# EAGLE design C64 SCSI-Interface (EAGLE 6.6.0)
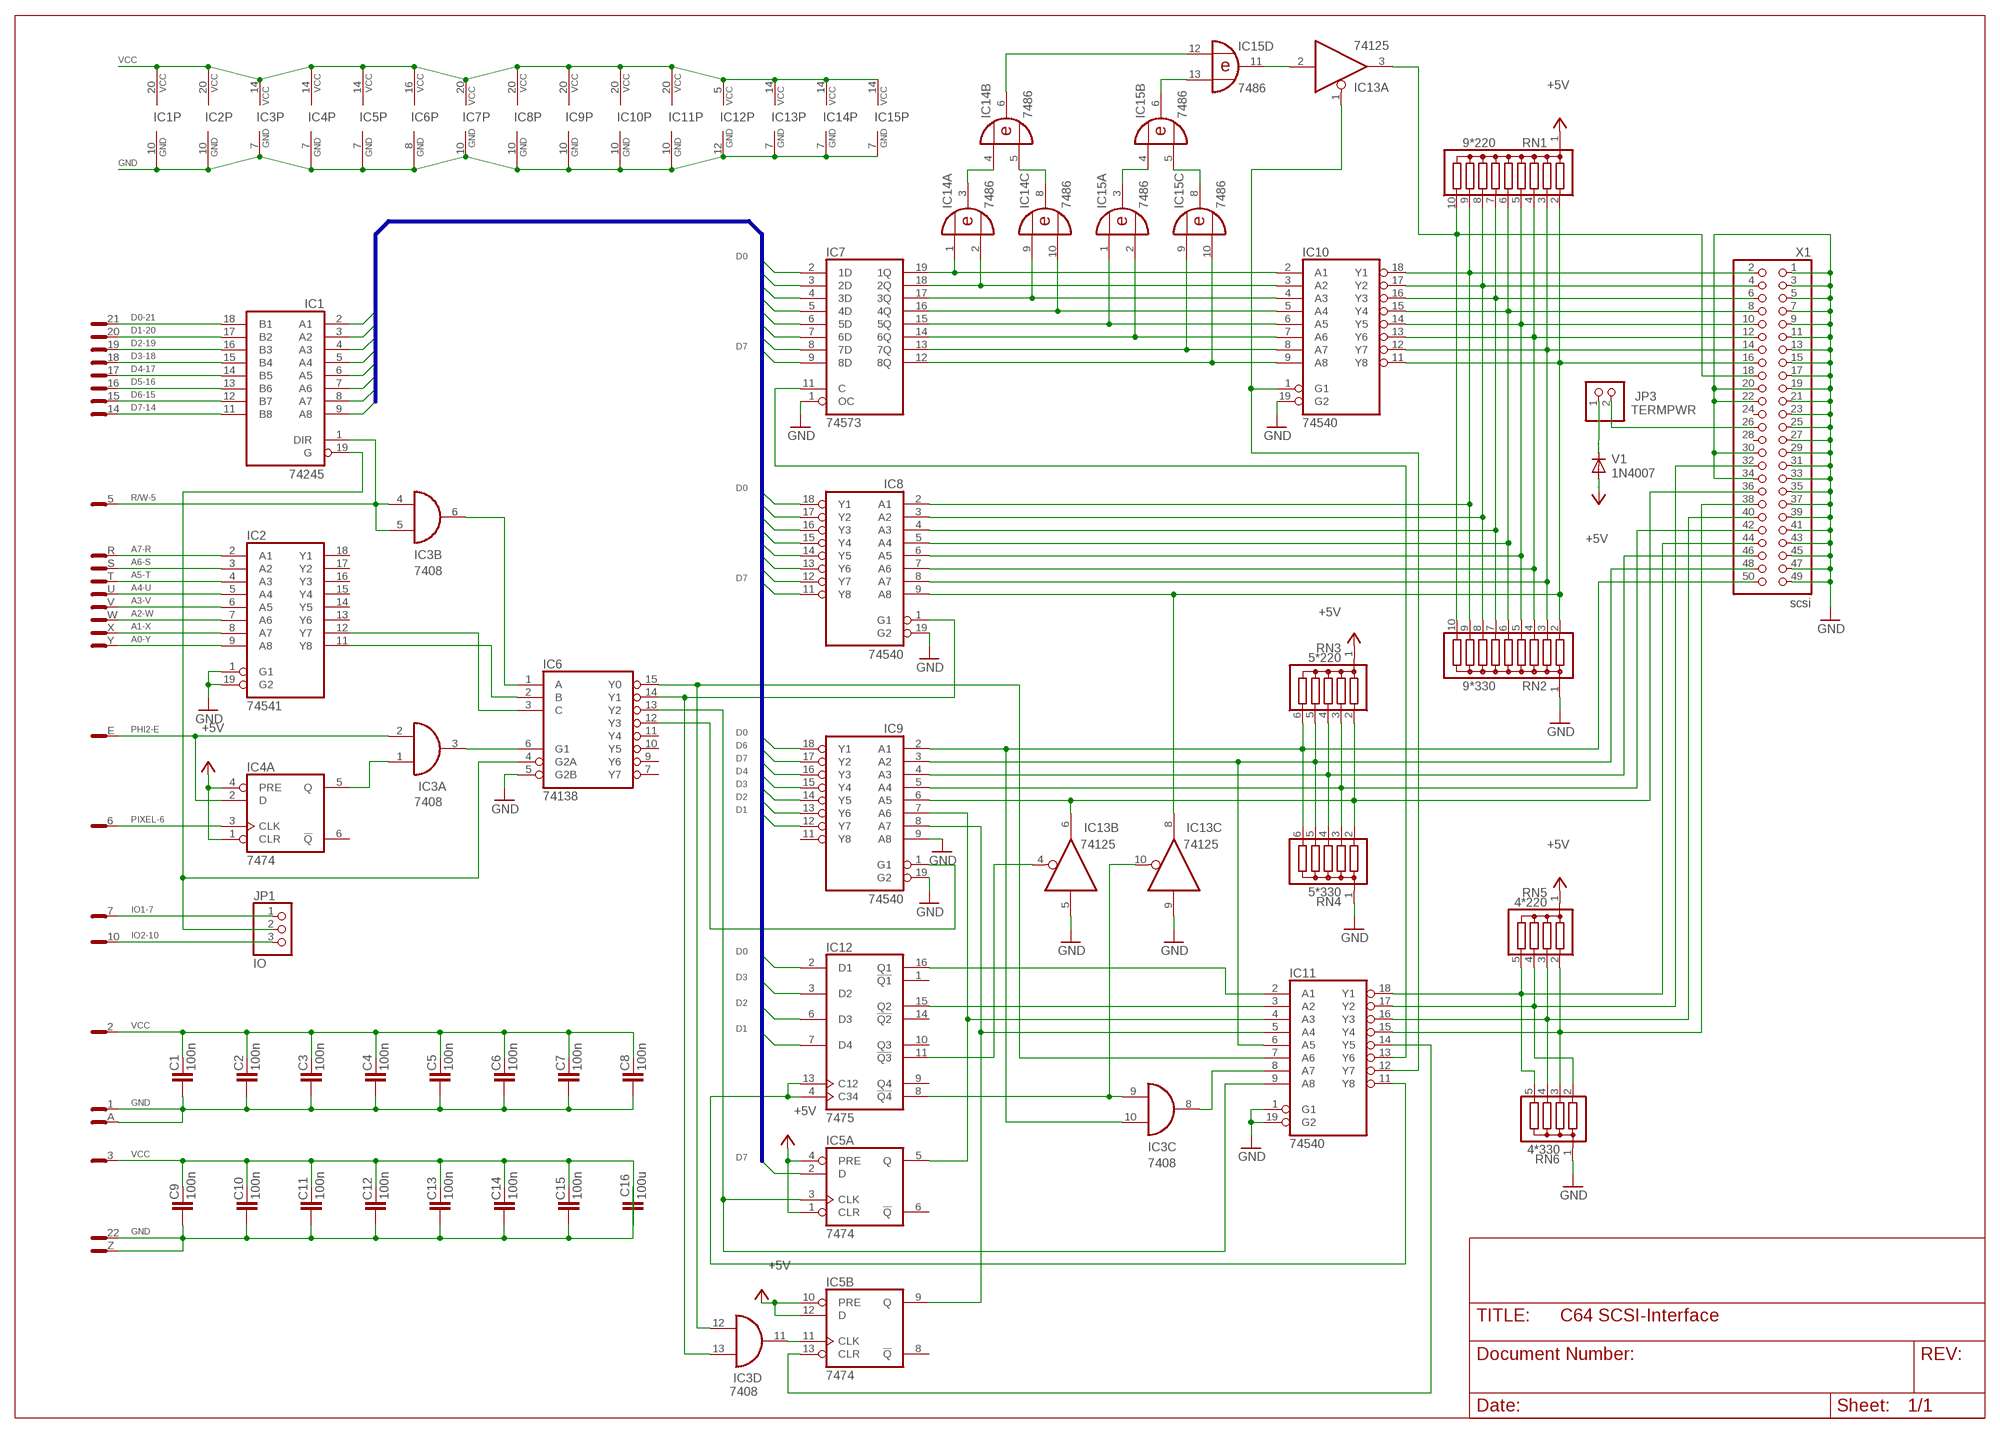
[diagram p0: schematic, sheet 1]

## Parts
C1  100n  C-EU050-025X075  [C050-025X075]
C2  100n  C-EU050-025X075  [C050-025X075]
C3  100n  C-EU050-025X075  [C050-025X075]
C4  100n  C-EU050-025X075  [C050-025X075]
C5  100n  C-EU050-025X075  [C050-025X075]
C6  100n  C-EU050-025X075  [C050-025X075]
C7  100n  C-EU050-025X075  [C050-025X075]
C8  100n  C-EU050-025X075  [C050-025X075]
C9  100n  C-EU050-025X075  [C050-025X075]
C10  100n  C-EU050-025X075  [C050-025X075]
C11  100n  C-EU050-025X075  [C050-025X075]
C12  100n  C-EU050-025X075  [C050-025X075]
C13  100n  C-EU050-025X075  [C050-025X075]
C14  100n  C-EU050-025X075  [C050-025X075]
C15  100n  C-EU050-025X075  [C050-025X075]
C16  100u  C-EU050-025X075  [C050-025X075]
IC1  74245  74LS245N  [DIL20]
IC2  74541  74LS541N  [DIL20]
IC3  7408  74LS08N  [DIL14]
IC4  7474  74LS74N  [DIL14]
IC5  7474  74LS74N  [DIL14]
IC6  74138  74LS138N  [DIL16]
IC7  74573  74HCT573N  [DIL20]
IC8  74540  74LS540N  [DIL20]
IC9  74540  74LS540N  [DIL20]
IC10  74540  74LS540N  [DIL20]
IC11  74540  74LS540N  [DIL20]
IC12  7475  74LS75N  [DIL16]
IC13  74125  74LS125N  [DIL14]
IC14  7486  74LS86N  [DIL14]
IC15  7486  74LS86N  [DIL14]
JP1  IO  PINHD-1X3  [1X03]
JP3  TERMPWR  PINHD-1X2  [1X02]
RN1  9*220  G09R  [SIL10]
RN2  9*330  G09R  [SIL10]
RN3  5*220  G05R  [SIL6]
RN4  5*330  G05R  [SIL6]
RN5  4*220  G04R  [SIL5]
RN6  4*330  G04R  [SIL5]
V1  1N4007  1N4004  [DO41-10]
X1  scsi  PINHD-2X25  [2X25]
X2  CARDCON22  [CARDCON2]

## Nets
A0: IC2.11(Y8) IC6.2(B)
A0-Y: IC2.9(A8) X2.Y
A1: IC2.12(Y7) IC6.3(C)
A1-X: IC2.8(A7) X2.X
A2-W: IC2.7(A6) X2.W
A3-V: IC2.6(A5) X2.V
A4-U: IC2.5(A4) X2.U
A5-T: IC2.4(A3) X2.T
A6-S: IC2.3(A2) X2.S
A7-R: IC2.2(A1) X2.R
D0: IC1.2(A1) IC7.2(1D) IC8.18(Y1) IC9.18(Y1) IC12.2(D1)
D0-21: IC1.18(B1) X2.21
D1: IC1.3(A2) IC7.3(2D) IC8.17(Y2) IC9.12(Y7) IC12.7(D4)
D1-20: IC1.17(B2) X2.20
D2: IC1.4(A3) IC7.4(3D) IC8.16(Y3) IC9.13(Y6) IC12.6(D3)
D2-19: IC1.16(B3) X2.19
D3: IC1.5(A4) IC7.5(4D) IC8.15(Y4) IC9.14(Y5) IC12.3(D2)
D3-18: IC1.15(B4) X2.18
D4: IC1.6(A5) IC7.6(5D) IC8.14(Y5) IC9.15(Y4)
D4-17: IC1.14(B5) X2.17
D5: IC1.7(A6) IC7.7(6D) IC8.13(Y6)
D5-16: IC1.13(B6) X2.16
D6: IC1.8(A7) IC7.8(7D) IC8.12(Y7) IC9.17(Y2)
D6-15: IC1.12(B7) X2.15
D7: IC1.9(A8) IC5.2(A:D) IC7.9(8D) IC8.11(Y8) IC9.16(Y3)
D7-14: IC1.11(B8) X2.14
GND: C1.1 C2.1 C3.1 C4.1 C5.1 C6.1 C7.1 C8.1 C9.1 C10.1 C11.1 C12.1 C13.1 C14.1 C15.1 C16.2 IC1.10(GND) IC2.1(G1) IC2.10(GND) IC2.19(G2) IC3.7(P:GND) IC4.7(P:GND) IC5.7(P:GND) IC6.5(G2B) IC6.8(GND) IC7.1(OC) IC7.10(GND) IC8.10(GND) IC8.19(G2) IC9.9(A8) IC9.10(GND) IC9.19(G2) IC10.10(GND) IC10.19(G2) IC11.1(G1) IC11.10(GND) IC11.19(G2) IC12.12(GND) IC13.5(B:I) IC13.7(P:GND) IC13.9(C:I) IC14.7(P:GND) IC15.7(P:GND) RN2.1 RN4.1 RN6.1 X1.1 X1.3 X1.5 X1.7 X1.9 X1.11 X1.13 X1.15 X1.17 X1.19 X1.20 X1.21 X1.22 X1.23 X1.25 X1.27 X1.29 X1.30 X1.31 X1.33 X1.34 X1.35 X1.37 X1.39 X1.41 X1.43 X1.45 X1.47 X1.49 X2.1 X2.22 X2.A X2.Z
IO: IC1.19(G) IC6.4(G2A) JP1.2
IO1-7: JP1.1 X2.7
IO2-10: JP1.3 X2.10
N$1: IC14.3(A:O) IC14.4(B:I0)
N$2: IC3.1(A:I0) IC4.5(A:Q)
N$3: IC6.12(Y3) IC9.1(G1)
N$4: IC14.5(B:I1) IC14.8(C:O)
N$5: IC14.6(B:O) IC15.12(D:I0)
N$6: IC15.6(B:O) IC15.13(D:I1)
N$7: IC15.3(A:O) IC15.4(B:I0)
N$8: IC15.5(B:I1) IC15.8(C:O)
N$9: IC3.11(D:O) IC5.11(B:CLK)
N$10: IC7.19(1Q) IC10.2(A1) IC14.1(A:I0)
N$11: IC7.18(2Q) IC10.3(A2) IC14.2(A:I1)
N$12: IC7.17(3Q) IC10.4(A3) IC14.9(C:I0)
N$13: IC7.16(4Q) IC10.5(A4) IC14.10(C:I1)
N$14: IC7.15(5Q) IC10.6(A5) IC15.1(A:I0)
N$15: IC7.14(6Q) IC10.7(A6) IC15.2(A:I1)
N$16: IC7.13(7Q) IC10.8(A7) IC15.9(C:I0)
N$17: IC7.12(8Q) IC10.9(A8) IC15.10(C:I1)
N$18: IC13.2(A:I) IC15.11(D:O)
N$19: IC10.1(G1) IC11.12(Y7) IC13.1(A:OE)
N$20: IC8.9(A8) IC10.11(Y8) IC13.8(C:O) RN1.2 RN2.2 X1.16
N$21: IC8.8(A7) IC10.12(Y7) RN1.3 RN2.3 X1.14
N$22: IC8.7(A6) IC10.13(Y6) RN1.4 RN2.4 X1.12
N$23: IC8.6(A5) IC10.14(Y5) RN1.5 RN2.5 X1.10
N$24: IC8.5(A4) IC10.15(Y4) RN1.6 RN2.6 X1.8
N$25: IC8.4(A3) IC10.16(Y3) RN1.7 RN2.7 X1.6
N$26: IC8.3(A2) IC10.17(Y2) RN1.8 RN2.8 X1.4
N$27: IC8.2(A1) IC10.18(Y1) RN1.9 RN2.9 X1.2
N$28: IC13.3(A:O) RN1.10 RN2.10 X1.18
N$29: IC3.9(C:I0) IC12.8(!Q4) IC13.10(C:OE)
N$30: IC12.11(!Q3) IC13.4(B:OE)
N$31: IC9.6(A5) IC13.6(B:O) RN3.2 RN4.2 X1.36
N$32: IC9.5(A4) RN3.3 RN4.3 X1.42
N$33: IC9.4(A3) RN3.4 RN4.4 X1.46
N$34: IC9.3(A2) IC11.6(A5) RN3.5 RN4.5 X1.48
N$35: IC3.10(C:I1) IC9.2(A1) RN3.6 RN4.6 X1.50
N$36: IC5.9(B:Q) IC9.8(A7) IC11.5(A4)
N$37: IC11.15(Y4) RN5.2 RN6.3 X1.38
N$38: IC11.16(Y3) RN5.3 RN6.4 X1.40
N$39: IC11.17(Y2) RN5.4 RN6.2 X1.32
N$40: IC11.18(Y1) RN5.5 RN6.5 X1.44
N$41: IC3.12(D:I0) IC6.15(Y0) IC11.7(A6)
N$42: IC5.3(A:CLK) IC6.13(Y2) IC11.9(A8)
N$43: IC5.5(A:Q) IC9.7(A6) IC11.4(A3)
N$44: IC3.13(D:I1) IC6.14(Y1) IC8.1(G1)
N$45: IC11.11(Y8) IC12.4(C34) IC12.13(C12)
N$46: IC11.2(A1) IC12.16(Q1)
N$47: IC11.3(A2) IC12.15(Q2)
N$49: IC5.13(B:CLR) IC11.14(Y5)
N$50: IC3.8(C:O) IC11.8(A7)
N$51: IC7.11(C) IC11.13(Y6)
N$53: JP3.1 V1.C
PHI2: IC3.3(A:O) IC6.6(G1)
PHI2-E: IC3.2(A:I1) IC4.2(A:D) X2.E
PIXEL-6: IC4.3(A:CLK) X2.6
R/-W: IC3.6(B:O) IC6.1(A)
R/W-5: IC1.1(DIR) IC3.4(B:I0) IC3.5(B:I1) X2.5
TERMPWR: JP3.2 X1.26
VCC: C1.2 C2.2 C3.2 C4.2 C5.2 C6.2 C7.2 C8.2 C9.2 C10.2 C11.2 C12.2 C13.2 C14.2 C15.2 C16.1 IC1.20(VCC) IC2.20(VCC) IC3.14(P:VCC) IC4.1(A:CLR) IC4.4(A:PRE) IC4.14(P:VCC) IC5.1(A:CLR) IC5.4(A:PRE) IC5.10(B:PRE) IC5.12(B:D) IC5.14(P:VCC) IC6.16(VCC) IC7.20(VCC) IC8.20(VCC) IC9.20(VCC) IC10.20(VCC) IC11.20(VCC) IC12.5(VCC) IC13.14(P:VCC) IC14.14(P:VCC) IC15.14(P:VCC) RN1.1 RN3.1 RN5.1 V1.A X2.2 X2.3 ; supply symbol labelled +5V
Unconnected: IC2.13(Y6) IC2.14(Y5) IC2.15(Y4) IC2.16(Y3) IC2.17(Y2) IC2.18(Y1) IC4.6(A:!Q) IC4.8(B:!Q) IC4.9(B:Q) IC4.10(B:PRE) IC4.11(B:CLK) IC4.12(B:D) IC4.13(B:CLR) IC5.6(A:!Q) IC5.8(B:!Q) IC6.7(Y7) IC6.9(Y6) IC6.10(Y5) IC6.11(Y4) IC9.11(Y8) IC12.1(!Q1) IC12.9(Q4) IC12.10(Q3) IC12.14(!Q2) IC13.11(D:O) IC13.12(D:I) IC13.13(D:OE) IC14.11(D:O) IC14.12(D:I0) IC14.13(D:I1) X1.24 X1.28 X2.4 X2.8 X2.9 X2.11 X2.12 X2.13 X2.B X2.C X2.D X2.F X2.H X2.J X2.K X2.L X2.M X2.N X2.P

## Buses
D[0..7]

## Library data of the parts
C1-C16 = rcl:C-EU: CAPACITOR, European symbol
IC1 = 74xx-us:74*245: Octal BUS TRANSCEIVER, 3-state
IC2 = 74xx-us:74*541: Octal BUFFER and LINE DRIVER, 3-state
IC3 = 74xx-eu:74*08: Quad 2-input AND gate
IC4 IC5 = 74xx-us:74*74: Dual D type positive edge triggered FLIP FLOP, preset and clear
IC6 = 74xx-us:74*138: 3-line to 8-line DECODER/DEMULTIPLEXER
IC7 = 74xx-eu:74*573: 8-bit D latch BUS DRIVER
IC8-IC11 = 74xx-us:74*540: Octal BUFFER and LINE DRIVER, 3-state
IC12 = 74xx-eu:74*75: 4-bit bistable LATCH
IC13 = 74xx-eu:74*125: Quad bus BUFFER, 3-state
IC14 IC15 = 74xx-eu:74*86: Quad 2-input EXCLUSIVE-OR (XOR) gate
JP1 = PINHEAD:PINHD-1X3: PIN HEADER
JP3 = PINHEAD:PINHD-1X2: PIN HEADER
RN1 RN2 = resistor-sil:G09R: SIL RESISTOR; OC_FARNELL: unknown; OC_NEWARK: unknown
RN3 RN4 = resistor-sil:G05R: SIL RESISTOR; OC_FARNELL: unknown; OC_NEWARK: unknown
RN5 RN6 = resistor-sil:G04R: SIL RESISTOR; OC_FARNELL: unknown; OC_NEWARK: unknown
V1 = diode:1N4004: DIODE general purpose rectifier, 1 A
X1 = PINHEAD:PINHD-2X25: PIN HEADER
X2 = CONNECT2:CARDCON22

## Board
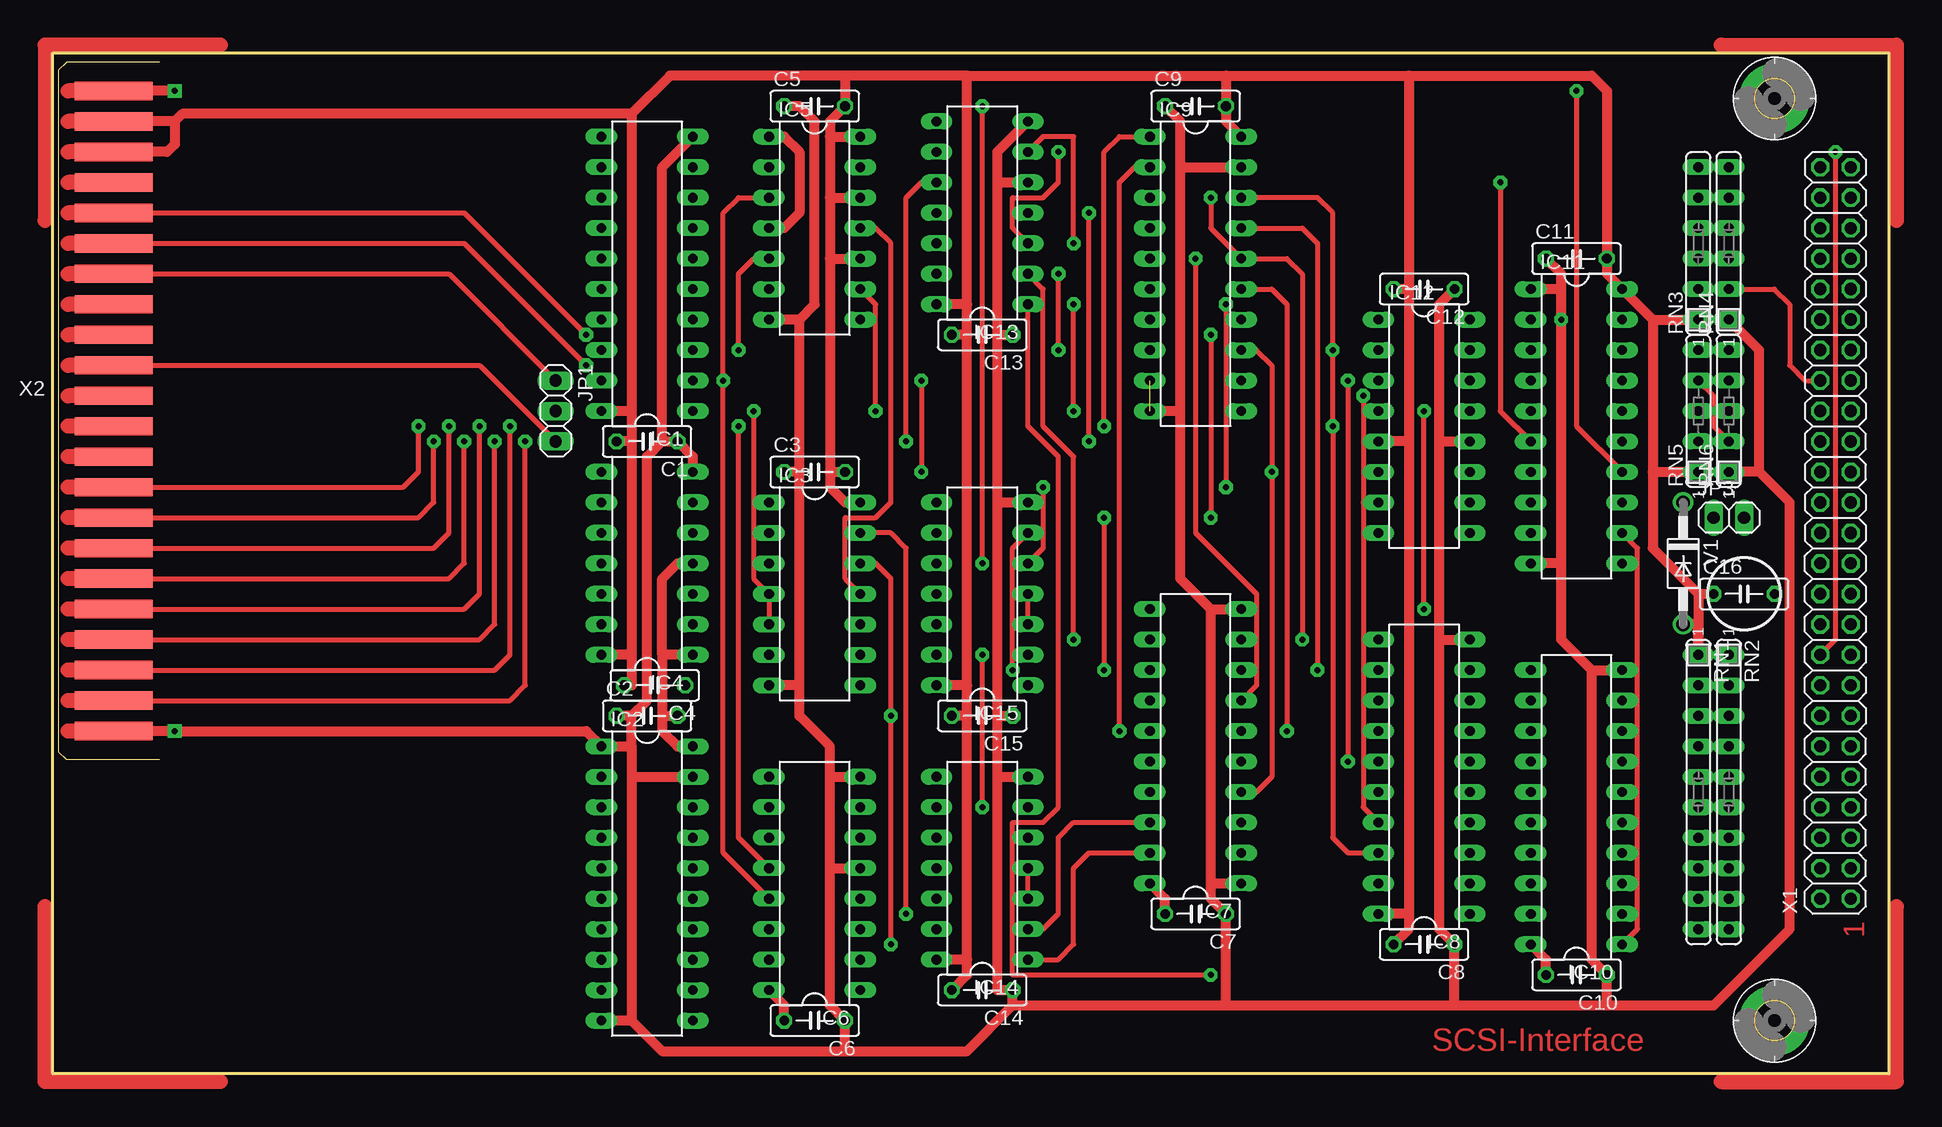
[diagram p1: board, top side]
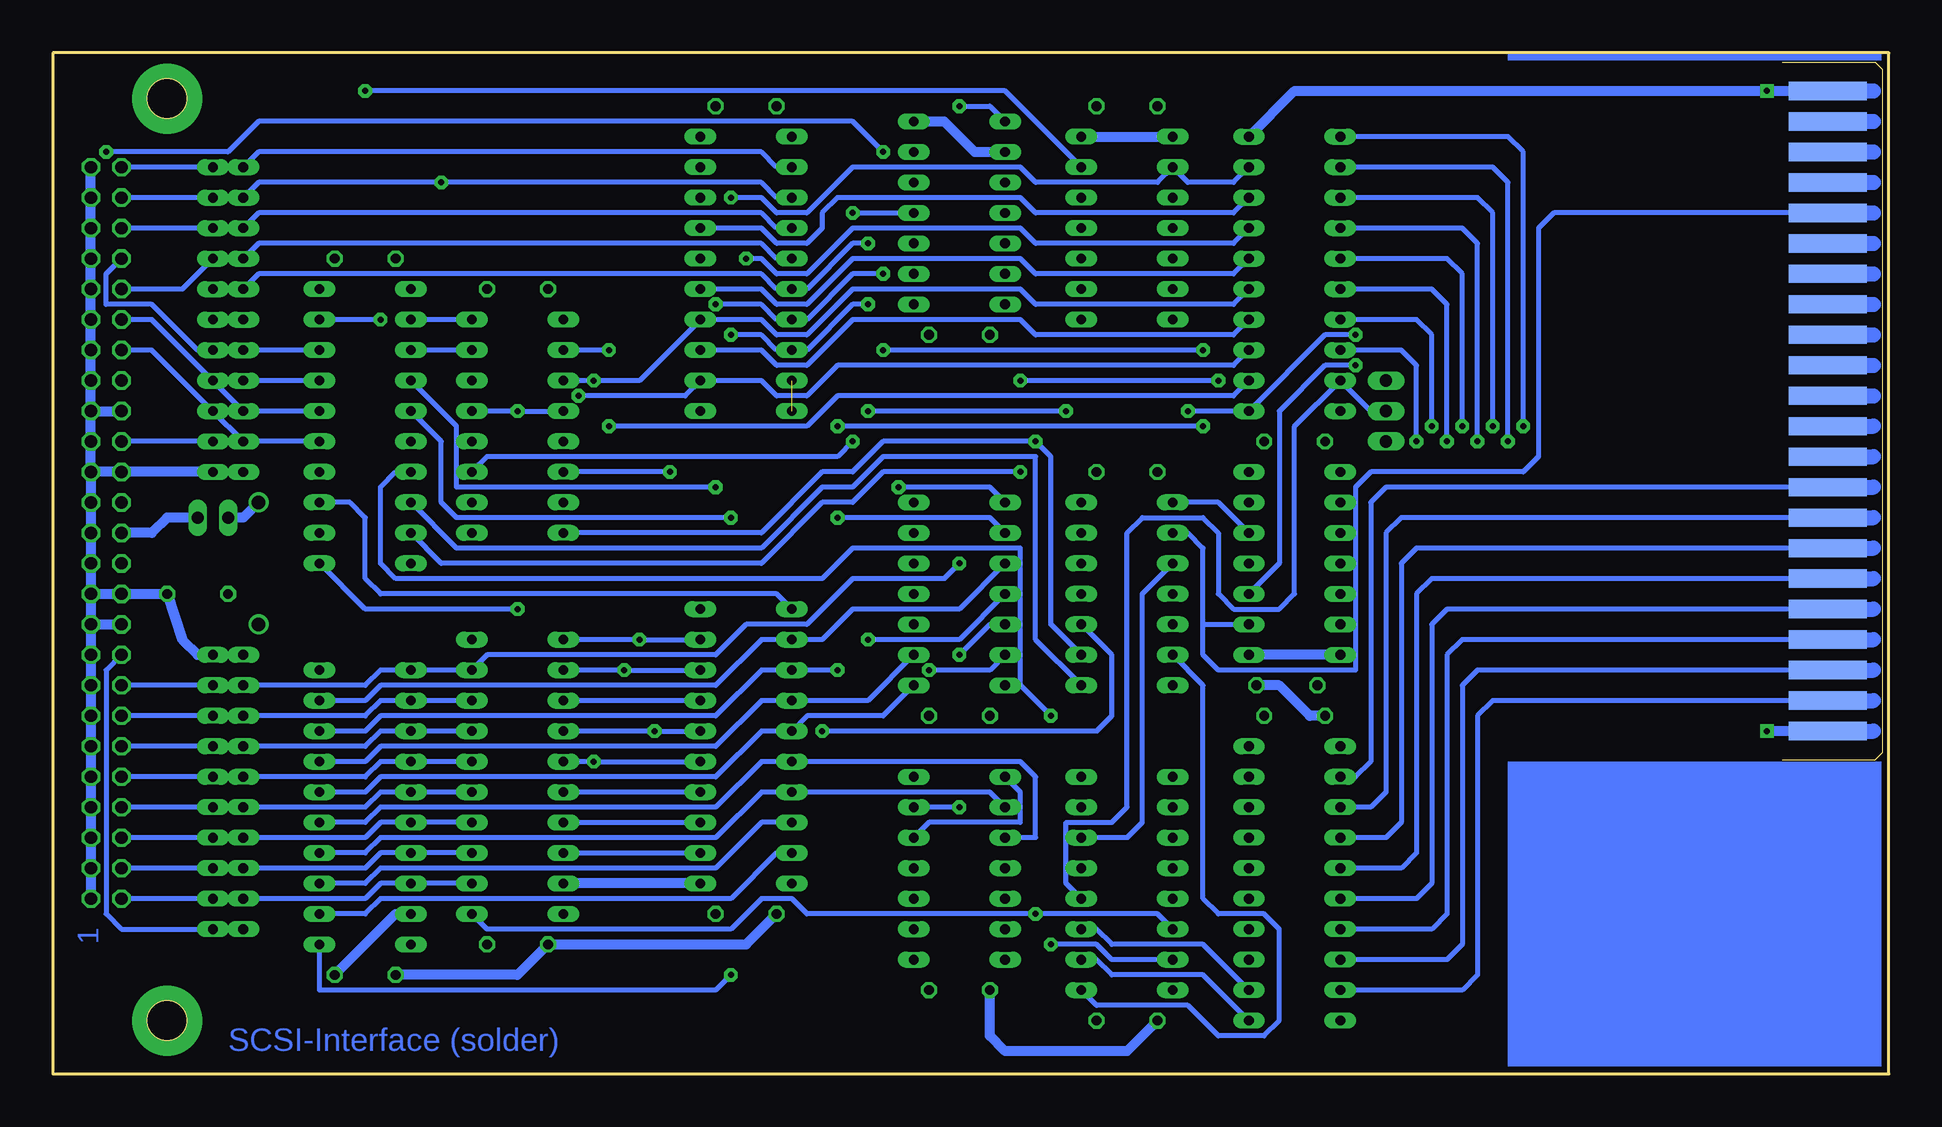
[diagram p2: board, bottom side, seen from below]

Size 153.03 x 85.09 mm. Coordinates in mm from the lower left corner, seen from the top.
Outline: 0,0 0,85.09 153.03,85.09 153.03,0 0,0
Copper layers (1*16): Top 0.035mm / dielectric 1.5mm / Bottom 0.035mm
Design rules "default *": minimum track width 10mil, minimum drill 19mil, track to track 8mil, track to pad 8mil, pad to pad 8mil, via to via 8mil, smd to smd 8mil, copper to edge 40mil, drill to drill 8mil, minimum pad ring 10mil, minimum via ring 8mil, stop-mask expansion 4mil, vias tented up to drill 0mil, thermal gap 10mil

### Footprints (pad centres in the part's own frame; a part is rotated, then mirrored left to right if it is on the bottom)
C050-025X075 = drill 0.813 octagon: 1 -2.54,0; 2 2.54,0
BO3,2-P = drill 3.2 pad 5.842: B3,2 0,0
DIL20 = drill 0.813 long: 1 -11.43,-3.81; 2 -8.89,-3.81; 3 -6.35,-3.81; 4 -3.81,-3.81; 5 -1.27,-3.81; 6 1.27,-3.81; 7 3.81,-3.81; 8 6.35,-3.81; 9 8.89,-3.81; 10 11.43,-3.81; 11 11.43,3.81; 12 8.89,3.81; 13 6.35,3.81; 14 3.81,3.81; 15 1.27,3.81; 16 -1.27,3.81; 17 -3.81,3.81; 18 -6.35,3.81; 19 -8.89,3.81; 20 -11.43,3.81
DIL14 = drill 0.813 long: 1 -7.62,-3.81; 2 -5.08,-3.81; 3 -2.54,-3.81; 4 0,-3.81; 5 2.54,-3.81; 6 5.08,-3.81; 7 7.62,-3.81; 8 7.62,3.81; 9 5.08,3.81; 10 2.54,3.81; 11 0,3.81; 12 -2.54,3.81; 13 -5.08,3.81; 14 -7.62,3.81
DIL16 = drill 0.813 long: 1 -8.89,-3.81; 2 -6.35,-3.81; 3 -3.81,-3.81; 4 -1.27,-3.81; 5 1.27,-3.81; 6 3.81,-3.81; 7 6.35,-3.81; 8 8.89,-3.81; 9 8.89,3.81; 10 6.35,3.81; 11 3.81,3.81; 12 1.27,3.81; 13 -1.27,3.81; 14 -3.81,3.81; 15 -6.35,3.81; 16 -8.89,3.81
1X03 = drill 1.016 long: 1 -2.54,0; 2 0,0; 3 2.54,0
1X02 = drill 1.016 long: 1 -1.27,0; 2 1.27,0
SIL10 = drill 0.813 long: 1 -11.43,0; 2 -8.89,0; 3 -6.35,0; 4 -3.81,0; 5 -1.27,0; 6 1.27,0; 7 3.81,0; 8 6.35,0; 9 8.89,0; 10 11.43,0
SIL6 = drill 0.813 long: 1 -6.35,0; 2 -3.81,0; 3 -1.27,0; 4 1.27,0; 5 3.81,0; 6 6.35,0
SIL5 = drill 0.813 long: 1 -5.08,0; 2 -2.54,0; 3 0,0; 4 2.54,0; 5 5.08,0
DO41-10 = drill 1.118: A 5.08,0; C -5.08,0
2X25 = drill 1.016 octagon: 1 -30.48,-1.27; 2 -30.48,1.27; 3 -27.94,-1.27; 4 -27.94,1.27; 5 -25.4,-1.27; 6 -25.4,1.27; 7 -22.86,-1.27; 8 -22.86,1.27; 9 -20.32,-1.27; 10 -20.32,1.27; 11 -17.78,-1.27; 12 -17.78,1.27; 13 -15.24,-1.27; 14 -15.24,1.27; 15 -12.7,-1.27; 16 -12.7,1.27; 17 -10.16,-1.27; 18 -10.16,1.27; 19 -7.62,-1.27; 20 -7.62,1.27; 21 -5.08,-1.27; 22 -5.08,1.27; 23 -2.54,-1.27; 24 -2.54,1.27; 25 0,-1.27; 26 0,1.27; 27 2.54,-1.27; 28 2.54,1.27; 29 5.08,-1.27; 30 5.08,1.27; 31 7.62,-1.27; 32 7.62,1.27; 33 10.16,-1.27; 34 10.16,1.27; 35 12.7,-1.27; 36 12.7,1.27; 37 15.24,-1.27; 38 15.24,1.27; 39 17.78,-1.27; 40 17.78,1.27; 41 20.32,-1.27; 42 20.32,1.27; 43 22.86,-1.27; 44 22.86,1.27; 45 25.4,-1.27; 46 25.4,1.27; 47 27.94,-1.27; 48 27.94,1.27; 49 30.48,-1.27; 50 30.48,1.27
CARDCON2 = smd 1.524 x 6.477: 1 55.88,3.81; 2 53.34,3.81; 3 50.8,3.81; 4 48.26,3.81; 5 45.72,3.81; 6 43.18,3.81; 7 40.64,3.81; 8 38.1,3.81; 9 35.56,3.81; 10 33.02,3.81; 11 30.48,3.81; 12 27.94,3.81; 13 25.4,3.81; 14 22.86,3.81; 15 20.32,3.81; 16 17.78,3.81; 17 15.24,3.81; 18 12.7,3.81; 19 10.16,3.81; 20 7.62,3.81; 21 5.08,3.81; 22 2.54,3.81 | smd 1.524 x 6.477 bottom: A 55.88,3.81; B 53.34,3.81; C 50.8,3.81; D 48.26,3.81; E 45.72,3.81; F 43.18,3.81; H 40.64,3.81; J 38.1,3.81; K 35.56,3.81; L 33.02,3.81; M 30.48,3.81; N 27.94,3.81; P 25.4,3.81; R 22.86,3.81; S 20.32,3.81; T 17.78,3.81; U 15.24,3.81; V 12.7,3.81; W 10.16,3.81; X 7.62,3.81; Y 5.08,3.81; Z 2.54,3.81

### Placement (x,y rotation side)
C1  49.53,52.7 180 top
C2  49.53,29.84 0 top
C3  63.5,50.16 0 top
C4  50.16,32.38 180 top
C5  63.5,80.65 0 top
C6  63.5,4.45 180 top
C7  95.25,13.34 180 top
C8  114.3,10.79 180 top
C9  95.25,80.65 0 top
C10  127,8.26 180 top
C11  127,67.95 0 top
C12  114.3,65.41 180 top
C13  77.47,61.59 180 top
C14  77.47,6.99 180 top
C15  77.47,29.84 180 top
C16  140.97,40 0 top
E$1  [BO3,2-P]  143.51,4.45 0 top
E$2  [BO3,2-P]  143.51,81.28 0 top
IC1  49.53,66.67 90 top
IC2  49.53,15.88 270 top
IC3  63.5,40 270 top
IC4  49.53,42.54 90 top
IC5  63.5,70.48 270 top
IC6  63.5,15.88 90 top
IC7  95.25,27.3 90 top
IC8  114.3,24.77 90 top
IC9  95.25,66.67 270 top
IC10  127,22.23 90 top
IC11  127,53.97 270 top
IC12  114.3,53.97 270 top
IC13  77.47,71.76 90 top
IC14  77.47,17.14 90 top
IC15  77.47,40 90 top
JP1  41.91,55.24 270 top
JP3  139.7,46.35 0 top
RN1  137.16,23.5 270 top
RN2  139.7,23.5 270 top
RN3  137.16,69.22 90 top
RN4  139.7,69.22 90 top
RN5  137.16,55.24 90 top
RN6  139.7,55.24 90 top
V1  135.89,42.54 270 top
X1  148.59,45.08 90 top
X2  8.89,26.04 90 top

### Tracks (layer width: path | path; a pad name or v marks a point on that pad's centre or on a via)
A0
  Bottom 0.406: IC2.11 57.15,8.26 64.77,8.26 66.04,9.53 IC6.2
A0-Y
  Bottom 0.406: IC2.9 35.56,6.99 34.29,8.26 34.29,29.84 33.02,31.11 X2.Y
A1
  Bottom 0.406: IC2.12 57.15,10.79 64.77,10.79 66.04,12.07 IC6.3
A1-X
  Bottom 0.406: IC2.8 36.83,9.53 35.56,10.79 35.56,32.38 34.29,33.65 X2.X
A2-W
  Bottom 0.406: IC2.7 38.1,12.07 36.83,13.34 36.83,34.92 35.56,36.2 X2.W
A3-V
  Bottom 0.406: IC2.6 39.37,14.61 38.1,15.88 38.1,37.46 36.83,38.73 X2.V
A4-U
  Bottom 0.406: IC2.5 40.64,17.14 39.37,18.41 39.37,40 38.1,41.27 X2.U
A5-T
  Bottom 0.406: IC2.4 41.91,19.68 40.64,20.96 40.64,42.54 39.37,43.81 X2.T
A6-S
  Bottom 0.406: IC2.3 43.18,22.23 41.91,23.5 41.91,45.08 40.64,46.35 X2.S
A7-R
  Bottom 0.406: IC2.2 44.45,24.77 43.18,26.04 43.18,47.62 41.91,48.89 X2.R
D0  (via drill 0.5 pad 1.14)
  Top 0.406: IC9.18 105.41,73.03 106.68,71.76 v106.68,60.32 v106.68,53.97 106.68,19.68 107.95,18.41 IC8.18
  Bottom 0.406: IC8.18 IC7.2 | IC1.2 54.61,56.51 87.63,56.51 90.17,53.97 v106.68,53.97 | v106.68,60.32 IC12.2
D0-21  (via drill 0.5 pad 1.14)
  Top 0.406: X2.21 38.1,31.11 39.37,32.38 v39.37,52.7
  Bottom 0.406: IC1.18 40.64,60.32 39.37,59.05 v39.37,52.7
D1  (via drill 0.5 pad 1.14)
  Top 0.406: 109.22,47.62 109.22,22.23 IC8.17 | 109.22,47.62 IC12.7 | v109.22,56.51 109.22,47.62
  Bottom 0.406: IC8.17 IC7.3 | IC1.3 54.61,59.05 87.63,59.05 90.17,56.51 92.71,56.51 93.98,57.78 IC9.12 100.33,56.51 v109.22,56.51
D1-20  (via drill 0.5 pad 1.14)
  Top 0.406: X2.20 36.83,33.65 38.1,34.92 v38.1,53.97
  Bottom 0.406: IC1.17 39.37,62.87 38.1,61.59 v38.1,53.97
D2  (via drill 0.5 pad 1.14)
  Top 0.406: IC9.13 100.33,60.32 101.6,59.05 v101.6,50.16 101.6,24.77 100.33,23.5 IC7.4
  Bottom 0.406: IC7.4 IC8.16 | IC1.4 54.61,61.59 71.12,61.59 72.39,62.87 86.36,62.87 90.17,59.05 92.71,59.05 93.98,60.32 IC9.13 | v101.6,50.16 IC12.6
D2-19  (via drill 0.5 pad 1.14)
  Top 0.406: X2.19 35.56,36.2 36.83,37.46 v36.83,52.7
  Bottom 0.406: IC1.16 38.1,65.41 36.83,64.14 v36.83,52.7
D3  (via drill 0.5 pad 1.14)
  Top 0.406: v107.95,57.78 v107.95,26.04
  Bottom 0.406: IC7.5 v107.95,26.04 IC8.15 | IC1.5 54.61,64.14 71.12,64.14 72.39,65.41 86.36,65.41 90.17,61.59 92.71,61.59 93.98,62.87 IC9.14 104.14,57.78 v107.95,57.78 IC12.3
D3-18  (via drill 0.5 pad 1.14)
  Top 0.406: X2.18 34.29,38.73 35.56,40 v35.56,53.97
  Bottom 0.406: IC1.15 36.83,67.95 35.56,66.67 v35.56,53.97
D4  (via drill 0.5 pad 1.14)
  Top 0.406: IC9.15 101.6,65.41 102.87,64.14 v102.87,28.57
  Bottom 0.406: IC7.6 v102.87,28.57 IC8.14 | IC1.6 54.61,66.67 71.12,66.67 72.39,67.95 86.36,67.95 90.17,64.14 92.71,64.14 93.98,65.41 IC9.15
D4-17  (via drill 0.5 pad 1.14)
  Top 0.406: X2.17 33.02,41.27 34.29,42.54 v34.29,52.7
  Bottom 0.406: IC1.14 35.56,70.48 34.29,69.22 v34.29,52.7
D5  (via drill 0.5 pad 1.14)
  Top 0.406: IC7.7 100.33,32.38 100.33,40 95.25,45.08 v95.25,67.95
  Bottom 0.406: IC7.7 IC8.13 | IC1.7 54.61,69.22 71.12,69.22 72.39,70.48 86.36,70.48 90.17,66.67 92.71,66.67 93.98,67.95 v95.25,67.95
D5-16  (via drill 0.5 pad 1.14)
  Top 0.406: X2.16 31.75,43.81 33.02,45.08 v33.02,53.97
  Bottom 0.406: IC1.13 34.29,73.03 33.02,71.76 v33.02,53.97
D6  (via drill 0.5 pad 1.14)
  Top 0.406: IC9.17 104.14,70.48 105.41,69.22 v105.41,33.65
  Bottom 0.406: IC7.8 v105.41,33.65 IC8.12 | IC1.8 54.61,71.76 71.12,71.76 72.39,73.03 87.63,73.03 88.9,71.76 88.9,70.48 90.17,69.22 92.71,69.22 93.98,70.48 IC9.17
D6-15  (via drill 0.5 pad 1.14)
  Top 0.406: X2.15 30.48,46.35 31.75,47.62 v31.75,52.7
  Bottom 0.406: IC1.12 33.02,75.56 31.75,74.3 v31.75,52.7
D7  (via drill 0.5 pad 1.14)
  Top 0.406: v104.14,36.2 104.14,66.67 102.87,67.95 IC9.16 96.52,70.48 v96.52,73.03
  Bottom 0.406: IC7.9 v104.14,36.2 IC8.11 | v96.52,73.03 93.98,73.03 92.71,71.76 90.17,71.76 86.36,75.56 72.39,75.56 71.12,74.3 60.96,74.3 IC5.2 58.42,74.3 54.61,74.3 IC1.9
D7-14  (via drill 0.5 pad 1.14)
  Top 0.406: X2.14 29.21,48.89 30.48,50.16 v30.48,53.97
  Bottom 0.406: IC1.11 31.75,78.11 30.48,76.84 v30.48,53.97
GND  (via drill 0.5 pad 1.14)  (1 unrouted)
  Top 0.813: C11.1 125.73,66.67 125.73,65.41 | 125.73,65.41 IC11.1 | 125.73,42.54 v125.73,62.87 125.73,65.41 | 125.73,42.54 IC11.10 | C9.1 93.98,79.38 93.98,75.56 | 93.98,55.24 93.98,75.56 | 93.98,55.24 IC9.10 | 78.74,61.59 C13.1 | 78.74,61.59 78.74,74.3 | 78.74,74.3 IC13.5 | 78.74,74.3 78.74,76.84 IC13.7 | C12.1 115.57,64.14 115.57,52.7 | 115.57,52.7 IC12.12 | 96.52,15.88 96.52,14.61 C7.1 97.79,5.71 | 96.52,15.88 IC7.1 | 96.52,15.88 96.52,38.73 | 96.52,38.73 IC7.10 | 115.57,36.2 IC8.10 | 115.57,36.2 115.57,12.07 C8.1 116.84,5.71 | 128.27,33.65 IC10.10 | 128.27,33.65 128.27,9.53 C10.1 129.54,5.71 | 78.74,24.77 IC14.7 | 78.74,24.77 78.74,6.99 C14.1 80.01,5.71 | 50.8,52.7 50.8,75.56 IC1.10 | 50.8,52.7 C1.1 53.34,51.43 IC4.7 | 62.23,32.38 IC3.7 | 62.23,32.38 62.23,50.16 | 62.23,50.16 C3.1 | C5.1 62.23,80.65 63.5,79.38 63.5,64.14 62.23,62.87 | 62.23,62.87 IC5.7 | 48.26,29.84 C2.1 | 48.26,27.3 48.26,29.84 | 48.26,27.3 IC2.1 44.45,28.57 v10.16,28.57 X2.Z | 78.74,29.84 C15.1 | 78.74,24.77 78.74,29.84 | 78.74,47.62 IC15.7 | 78.74,29.84 78.74,47.62 | 78.74,47.62 78.74,61.59 | 64.77,17.14 64.77,5.71 C6.1 66.04,1.9 | 64.77,17.14 64.77,24.77 | 64.77,24.77 IC6.8 | RN4.1 142.24,60.32 142.24,50.16 | 142.24,50.16 RN6.1 | 115.57,36.2 115.57,52.7 | 125.73,42.54 125.73,36.2 128.27,33.65 | 93.98,55.24 93.98,41.27 96.52,38.73 | 66.04,1.9 76.2,1.9 80.01,5.71 | 80.01,5.71 97.79,5.71 | 97.79,5.71 116.84,5.71 | 116.84,5.71 129.54,5.71 | 62.23,32.38 62.23,29.84 64.77,27.3 64.77,24.77 | 62.23,50.16 62.23,62.87 | 50.8,52.7 49.53,51.43 49.53,31.11 48.26,29.84 | 48.26,27.3 48.26,24.77 | 48.26,24.77 48.26,4.45 | 48.26,4.45 IC2.10 | 48.26,4.45 50.8,1.9 66.04,1.9 | 48.26,24.77 IC2.19 | 64.77,17.14 IC6.5
  Top 0.813: 93.98,75.56 IC9.19 | 142.24,50.16 144.78,47.62 144.78,12.07 138.43,5.71 129.54,5.71 | v10.16,81.92 X2.A
  Bottom 0.406: v125.73,62.87 IC11.19
  Bottom 0.813: X1.49 X1.47 X1.45 X1.43 X1.41 X1.39 X1.37 X1.35 X1.33 | X1.33 X1.31 X1.29 | X1.29 X1.27 X1.25 X1.23 X1.21 | X1.21 X1.19 | X1.19 X1.17 X1.15 X1.13 X1.11 X1.9 X1.7 X1.5 X1.3 X1.1 | X1.33 X1.34 | X1.29 X1.30 RN6.1 | X1.19 X1.20 | X1.21 X1.22 C16.2 142.24,36.2 140.97,34.92 RN2.1 | IC7.1 IC8.19 | IC13.9 76.2,76.84 78.74,79.38 IC13.7 | IC10.19 124.46,13.34 C10.1 | C4.1 50.8,32.38 48.26,29.84 C2.1 | IC1.10 49.53,81.92 v10.16,81.92 X2.A | X2.Z v10.16,28.57
IO
  Bottom 0.406: JP1.2 43.18,55.24 IC1.19 49.53,53.97 49.53,40 50.8,38.73 54.61,38.73 55.88,40 55.88,45.08 57.15,46.35 62.23,46.35 63.5,45.08 63.5,22.23 64.77,20.96 68.58,20.96 68.58,15.88 IC6.4
IO1-7
  Top 0.406: X2.7 33.02,66.67 JP1.1
IO2-10
  Top 0.406: X2.10 35.56,59.05 JP1.3
N$1
  Top 0.406: IC14.3 IC14.4
N$2
  Bottom 0.406: IC3.1 55.88,47.62 IC4.5
N$3  (via drill 0.5 pad 1.14)
  Top 0.406: IC6.12 57.15,19.68 v57.15,53.97 | v87.63,53.97 87.63,76.84 88.9,78.11 IC9.1
  Bottom 0.406: v57.15,53.97 v87.63,53.97
N$4
  Bottom 0.406: IC14.5 80.01,20.96 72.39,20.96 72.39,23.5 IC14.8
N$5  (via drill 0.5 pad 1.14)
  Top 0.406: v77.47,22.23 v77.47,34.92
  Bottom 0.406: IC15.12 74.93,37.46 v77.47,34.92 | v77.47,22.23 IC14.6
N$6  (via drill 0.5 pad 1.14)
  Top 0.406: IC15.6 80.01,43.81 v80.01,33.65
  Bottom 0.406: v80.01,33.65 74.93,33.65 IC15.13
N$7
  Top 0.406: IC15.3 IC15.4
N$8  (via drill 0.5 pad 1.14)
  Top 0.406: v82.55,48.89 82.55,43.81 IC15.5
  Bottom 0.406: IC15.8 74.93,48.89 v82.55,48.89
N$9
  Top 0.406: IC5.11 68.58,70.48 69.85,69.22 69.85,47.62 68.58,46.35 66.04,46.35 66.04,41.27 IC3.11
N$10
  Top 0.406: IC7.19 86.36,18.41 85.09,17.14 85.09,10.79 83.82,9.53 IC14.1
  Bottom 0.406: IC10.2 127,13.34 125.73,14.61 96.52,14.61 92.71,18.41 IC7.19
N$11
  Top 0.406: IC7.18 85.09,20.96 83.82,19.68 83.82,13.34 82.55,12.07 IC14.2
  Bottom 0.406: IC10.3 127,15.88 125.73,17.14 97.79,17.14 93.98,20.96 IC7.18
N$12
  Bottom 0.406: IC10.4 127,18.41 125.73,19.68 97.79,19.68 93.98,23.5 IC7.17 74.93,23.5 IC14.9
N$13
  Bottom 0.406: IC10.5 127,20.96 125.73,22.23 97.79,22.23 93.98,26.04 IC7.16 72.39,26.04 71.12,24.77 71.12,19.68 IC14.10
N$14
  Bottom 0.406: IC10.6 127,23.5 125.73,24.77 97.79,24.77 93.98,28.57 IC7.15 90.17,29.84 83.82,29.84 IC15.1
N$15
  Bottom 0.406: IC10.7 127,26.04 125.73,27.3 97.79,27.3 93.98,31.11 IC7.14 85.09,31.11 IC15.2
N$16  (via drill 0.5 pad 1.14)
  Top 0.406: v87.63,46.35 v87.63,33.65
  Bottom 0.406: IC10.8 127,28.57 125.73,29.84 97.79,29.84 93.98,33.65 IC7.13 v87.63,33.65 | IC15.9 74.93,46.35 v87.63,46.35
N$17
  Bottom 0.406: IC10.9 127,31.11 125.73,32.38 97.79,32.38 93.98,36.2 IC7.12 88.9,36.2 86.36,38.73 77.47,38.73 IC15.10
N$18  (via drill 0.5 pad 1.14)
  Top 0.406: IC13.2 82.55,65.41 82.55,53.97 85.09,51.43 v85.09,36.2
  Bottom 0.406: IC15.11 77.47,36.2 v85.09,36.2
N$19  (via drill 0.5 pad 1.14)
  Top 0.406: IC11.12 132.08,43.81 132.08,12.07 IC10.1 | IC13.1 81.28,53.97 83.82,51.43 83.82,22.23 82.55,20.96 80.01,20.96 80.01,8.26 v96.52,8.26
  Bottom 0.406: v96.52,8.26 97.79,6.99 130.81,6.99 IC10.1
N$20  (via drill 0.5 pad 1.14)
  Top 0.406: v77.47,42.54 v77.47,80.65
  Bottom 0.406: X1.16 RN2.2 RN1.2 127,32.38 125.73,33.65 IC10.11 IC8.9 116.84,34.92 97.79,34.92 95.25,37.46 90.17,37.46 86.36,41.27 78.74,41.27 v77.47,42.54 | IC13.8 74.93,80.65 v77.47,80.65
N$21
  Bottom 0.406: X1.14 RN2.3 RN1.3 127,29.84 125.73,31.11 IC10.12 IC8.8
N$22
  Bottom 0.406: X1.12 RN2.4 RN1.4 127,27.3 125.73,28.57 IC10.13 IC8.7
N$23
  Bottom 0.406: X1.10 RN2.5 RN1.5 127,24.77 125.73,26.04 IC10.14 IC8.6
N$24
  Bottom 0.406: X1.8 RN2.6 RN1.6 127,22.23 125.73,23.5 IC10.15 IC8.5
N$25
  Bottom 0.406: X1.6 RN2.7 RN1.7 127,19.68 125.73,20.96 IC10.16 IC8.4
N$26
  Bottom 0.406: X1.4 RN2.8 RN1.8 127,17.14 125.73,18.41 IC10.17 IC8.3
N$27
  Bottom 0.406: X1.2 RN2.9 RN1.9 127,14.61 125.73,15.88 IC10.18 IC8.2
N$28  (via drill 0.5 pad 1.14)
  Top 0.406: X1.18 148.59,36.2 v148.59,76.84 | v83.82,76.84 83.82,74.3 82.55,73.03 80.01,73.03 80.01,70.48 IC13.3
  Bottom 0.406: RN1.10 RN2.10 147.32,12.07 148.59,13.34 148.59,33.65 X1.18 | v148.59,76.84 138.43,76.84 135.89,79.38 86.36,79.38 v83.82,76.84
N$29  (via drill 0.5 pad 1.14)
  Top 0.406: IC13.10 72.39,74.3 71.12,73.03 v71.12,52.7
  Bottom 0.406: IC3.9 69.85,37.46 69.85,51.43 v71.12,52.7 83.82,52.7 86.36,50.16 88.9,50.16 93.98,45.08 IC12.8
N$30  (via drill 0.5 pad 1.14)
  Top 0.406: v86.36,52.7 v86.36,71.76
  Bottom 0.406: IC12.11 116.84,51.43 87.63,51.43 v86.36,52.7 | v86.36,71.76 IC13.4
N$31  (via drill 0.5 pad 1.14)
  Top 0.406: X1.36 146.05,57.78 144.78,59.05 144.78,64.14 143.51,65.41 RN4.2 | IC13.6 82.55,78.11 85.09,78.11 v85.09,69.22
  Bottom 0.406: RN4.2 RN3.2 135.89,66.67 93.98,66.67 92.71,65.41 IC9.6 90.17,65.41 86.36,69.22 v85.09,69.22
N$32
  Bottom 0.406: X1.42 142.24,65.41 RN4.3 RN3.3 135.89,69.22 93.98,69.22 92.71,67.95 IC9.5
N$33
  Bottom 0.406: X1.46 RN4.4 RN3.4 135.89,71.76 93.98,71.76 92.71,70.48 IC9.4
N$34  (via drill 0.5 pad 1.14)
  Top 0.406: IC11.6 120.65,55.24 v120.65,74.3
  Bottom 0.406: X1.48 RN4.5 RN3.5 135.89,74.3 v120.65,74.3 93.98,74.3 92.71,73.03 IC9.3
N$35  (via drill 0.5 pad 1.14)
  Top 0.406: IC9.2 90.17,75.56 88.9,74.3 v88.9,28.57
  Bottom 0.406: X1.50 RN4.6 RN3.6 135.89,76.84 93.98,76.84 92.71,75.56 IC9.2 | IC3.10 64.77,34.92 64.77,29.84 66.04,28.57 v88.9,28.57
N$36  (via drill 0.5 pad 1.14)
  Top 0.406: v96.52,61.59 v96.52,46.35 | IC5.9 68.58,64.14 v68.58,55.24 | v85.09,55.24 v85.09,64.14
  Bottom 0.406: IC11.5 120.65,52.7 120.65,47.62 119.38,46.35 v96.52,46.35 | v96.52,61.59 93.98,61.59 92.71,60.32 IC9.8 90.17,60.32 86.36,64.14 v85.09,64.14 | v68.58,55.24 v85.09,55.24
N$37
  Bottom 0.406: IC11.15 RN5.2 RN6.3 144.78,60.32 X1.38
N$38
  Bottom 0.406: IC11.16 RN5.3 RN6.4 144.78,62.87 X1.40
N$39
  Top 0.406: RN5.4 138.43,56.51 138.43,53.97 RN6.2
  Bottom 0.406: IC11.17 RN5.4 | RN6.2 X1.32
N$40
  Bottom 0.406: IC11.18 RN5.5 RN6.5 140.97,60.32 144.78,64.14 148.59,64.14 148.59,66.67 X1.44
N$41  (via drill 0.5 pad 1.14)
  Top 0.406: IC3.12 68.58,42.54 69.85,41.27 v69.85,29.84 v69.85,10.79
  Bottom 0.406: IC6.15 64.77,9.53 66.04,10.79 v69.85,10.79 | IC11.7 124.46,50.16 125.73,48.89 125.73,42.54 124.46,41.27 88.9,41.27 86.36,43.81 72.39,43.81 72.39,32.38 v69.85,29.84
N$42  (via drill 0.5 pad 1.14)
  Top 0.406: IC6.13 55.88,18.41 v55.88,57.78 55.88,71.76 57.15,73.03 IC5.3 | v72.39,57.78 v72.39,50.16
  Bottom 0.406: IC11.9 120.65,42.54 93.98,42.54 88.9,47.62 86.36,47.62 83.82,50.16 v72.39,50.16 | v55.88,57.78 v72.39,57.78
N$43  (via drill 0.5 pad 1.14)
  Top 0.406: v97.79,64.14 v97.79,48.89 | IC5.5 58.42,67.95 57.15,66.67 v57.15,60.32 | v83.82,60.32 v83.82,66.67
  Bottom 0.406: IC11.4 119.38,53.97 119.38,48.89 v97.79,48.89 | v97.79,64.14 93.98,64.14 92.71,62.87 IC9.7 90.17,62.87 86.36,66.67 v83.82,66.67 | v57.15,60.32 v83.82,60.32
N$44  (via drill 0.5 pad 1.14)
  Top 0.406: IC3.13 69.85,45.08 71.12,43.81 v71.12,13.34
  Bottom 0.406: IC8.1 116.84,12.07 96.52,12.07 93.98,14.61 91.44,14.61 90.17,13.34 v71.12,13.34 60.96,13.34 IC6.14
N$45  (via drill 0.5 pad 1.14)
  Top 0.406: v114.3,38.73 v114.3,55.24
  Bottom 0.406: IC12.4 v114.3,55.24 IC12.13 | IC11.11 127,38.73 v114.3,38.73
N$46
  Bottom 0.406: IC12.16 IC11.2
N$47
  Bottom 0.406: IC12.15 IC11.3
N$48
  Top 1.27: 13.97,85.73 -0.64,85.73 -0.64,71.12
N$49  (via drill 0.5 pad 1.14)
  Top 0.406: v127,81.92 127,53.97 IC11.14
  Bottom 0.406: IC5.13 73.66,81.92 v127,81.92
N$50
  Bottom 0.406: IC3.8 71.12,36.2 71.12,51.43 83.82,51.43 86.36,48.89 88.9,48.89 93.98,43.81 119.38,43.81 IC11.8
N$51
  Bottom 0.406: IC7.11 92.71,40 125.73,40 127,41.27 127,46.35 128.27,47.62 IC11.13
N$52
  Top 1.27: 13.97,-0.64 -0.64,-0.64 -0.64,13.97
N$53
  Bottom 0.813: V1.C 137.16,46.35 JP3.1
N$54
  Top 1.27: 139.06,-0.64 153.67,-0.64 153.67,13.97
N$55
  Top 1.27: 139.06,85.73 153.67,85.73 153.67,71.12
PHI2
  Bottom 0.406: IC3.3 62.23,40 62.23,20.96 63.5,19.68 IC6.6
PHI2-E
  Bottom 0.406: 57.15,37.46 57.15,34.92 55.88,33.65 44.45,33.65 44.45,48.89 43.18,50.16 30.48,50.16 29.21,51.43 29.21,70.48 27.94,71.76 X2.E | 57.15,37.46 IC4.2 | IC3.2 58.42,45.08 57.15,43.81 57.15,37.46
PIXEL-6  (via drill 0.5 pad 1.14)
  Top 0.406: v44.45,59.05 34.29,69.22 X2.6
  Bottom 0.406: IC4.3 50.8,42.54 50.8,55.24 46.99,59.05 v44.45,59.05
R/-W
  Bottom 0.406: IC3.6 57.15,32.38 57.15,14.61 55.88,13.34 52.07,13.34 50.8,12.07 50.8,4.45 52.07,3.18 55.88,3.18 58.42,5.71 66.04,5.71 IC6.1
R/W-5  (via drill 0.5 pad 1.14)
  Top 0.406: IC3.5 IC3.4 58.42,41.27 v58.42,55.24 | X2.5 34.29,71.76 v44.45,61.59
  Bottom 0.406: v58.42,55.24 IC1.1 46.99,61.59 v44.45,61.59
TERMPWR
  Bottom 0.813: X1.26 144.78,45.08 143.51,46.35 JP3.2
VCC
  Top 0.813: V1.A 137.16,37.46 RN1.1 137.16,40 | IC9.20 97.79,79.38 C9.2 97.79,83.19 | 113.03,65.41 C12.2 | 113.03,65.41 113.03,52.7 | 113.03,52.7 IC12.5 | 76.2,61.59 C13.2 | 76.2,61.59 76.2,64.14 | 76.2,64.14 IC13.14 | C7.2 92.71,14.61 IC7.20 | 113.03,13.34 113.03,12.07 C8.2 | 113.03,13.34 IC8.20 | C10.2 124.46,9.53 IC10.20 | 76.2,9.53 IC14.14 | 76.2,9.53 76.2,8.26 C14.2 | 76.2,29.84 C15.2 | 76.2,29.84 76.2,32.38 | 76.2,32.38 IC15.14 | 76.2,9.53 76.2,29.84 | 48.26,55.24 IC1.20 | 48.26,55.24 48.26,52.7 | 48.26,52.7 C1.2 | 48.26,34.92 IC4.14 | 48.26,34.92 48.26,32.38 C4.2 | 48.26,52.7 48.26,34.92 | 64.77,50.16 C3.2 | 64.77,50.16 64.77,48.89 66.04,47.62 IC3.14 | 64.77,78.11 64.77,79.38 C5.2 66.04,83.19 | 64.77,78.11 IC5.14 | 64.77,67.95 64.77,50.16 | 64.77,73.03 64.77,67.95 | 64.77,78.11 64.77,73.03 | 76.2,32.38 76.2,61.59 | 113.03,52.7 113.03,13.34 | 50.8,29.84 C2.2 | 50.8,29.84 50.8,28.57 52.07,27.3 IC2.20 | 50.8,34.92 50.8,29.84 | IC4.1 50.8,34.92 | 50.8,34.92 50.8,41.27 52.07,42.54 IC4.4 | 64.77,73.03 IC5.12 | 64.77,67.95 IC5.10 | IC6.16 60.96,5.71 C6.2 | 133.35,62.87 RN3.1 | 133.35,62.87 133.35,50.16 | 133.35,62.87 IC11.20 129.54,66.67 C11.2 129.54,81.92 128.27,83.19 113.03,83.19 | 133.35,50.16 RN5.1 | 133.35,50.16 133.35,43.81 137.16,40 | 137.16,40 C16.1 | 48.26,80.01 48.26,55.24 | 66.04,83.19 51.43,83.19 48.26,80.01 | 76.2,83.19 66.04,83.19 | 76.2,83.19 97.79,83.19 | 97.79,83.19 113.03,83.19 | 113.03,83.19 113.03,65.41 | 76.2,64.14 76.2,83.19 | IC5.1 60.96,78.11 62.23,76.84 62.23,71.76 60.96,70.48 IC5.4 | 10.16,79.38 10.16,77.47 9.53,76.84 X2.3 | 48.26,80.01 10.79,80.01 10.16,79.38 | 10.16,79.38 X2.2
  Bottom 0.813: C7.2 95.25,10.79 C8.2 114.3,8.26 C10.2 | C6.2 63.5,1.9 73.66,1.9 74.93,3.18 C14.2 | IC4.14 IC4.1 | IC5.14 IC5.1
(copper drawn outside any net)
  shapes: Bottom area x2

### Text on the board
Top: 1 | SCSI-Interface
Bottom: 1 | SCSI-Interface (solder)